# EAGLE schematic fretscanner1 (EAGLE 6.6.0)
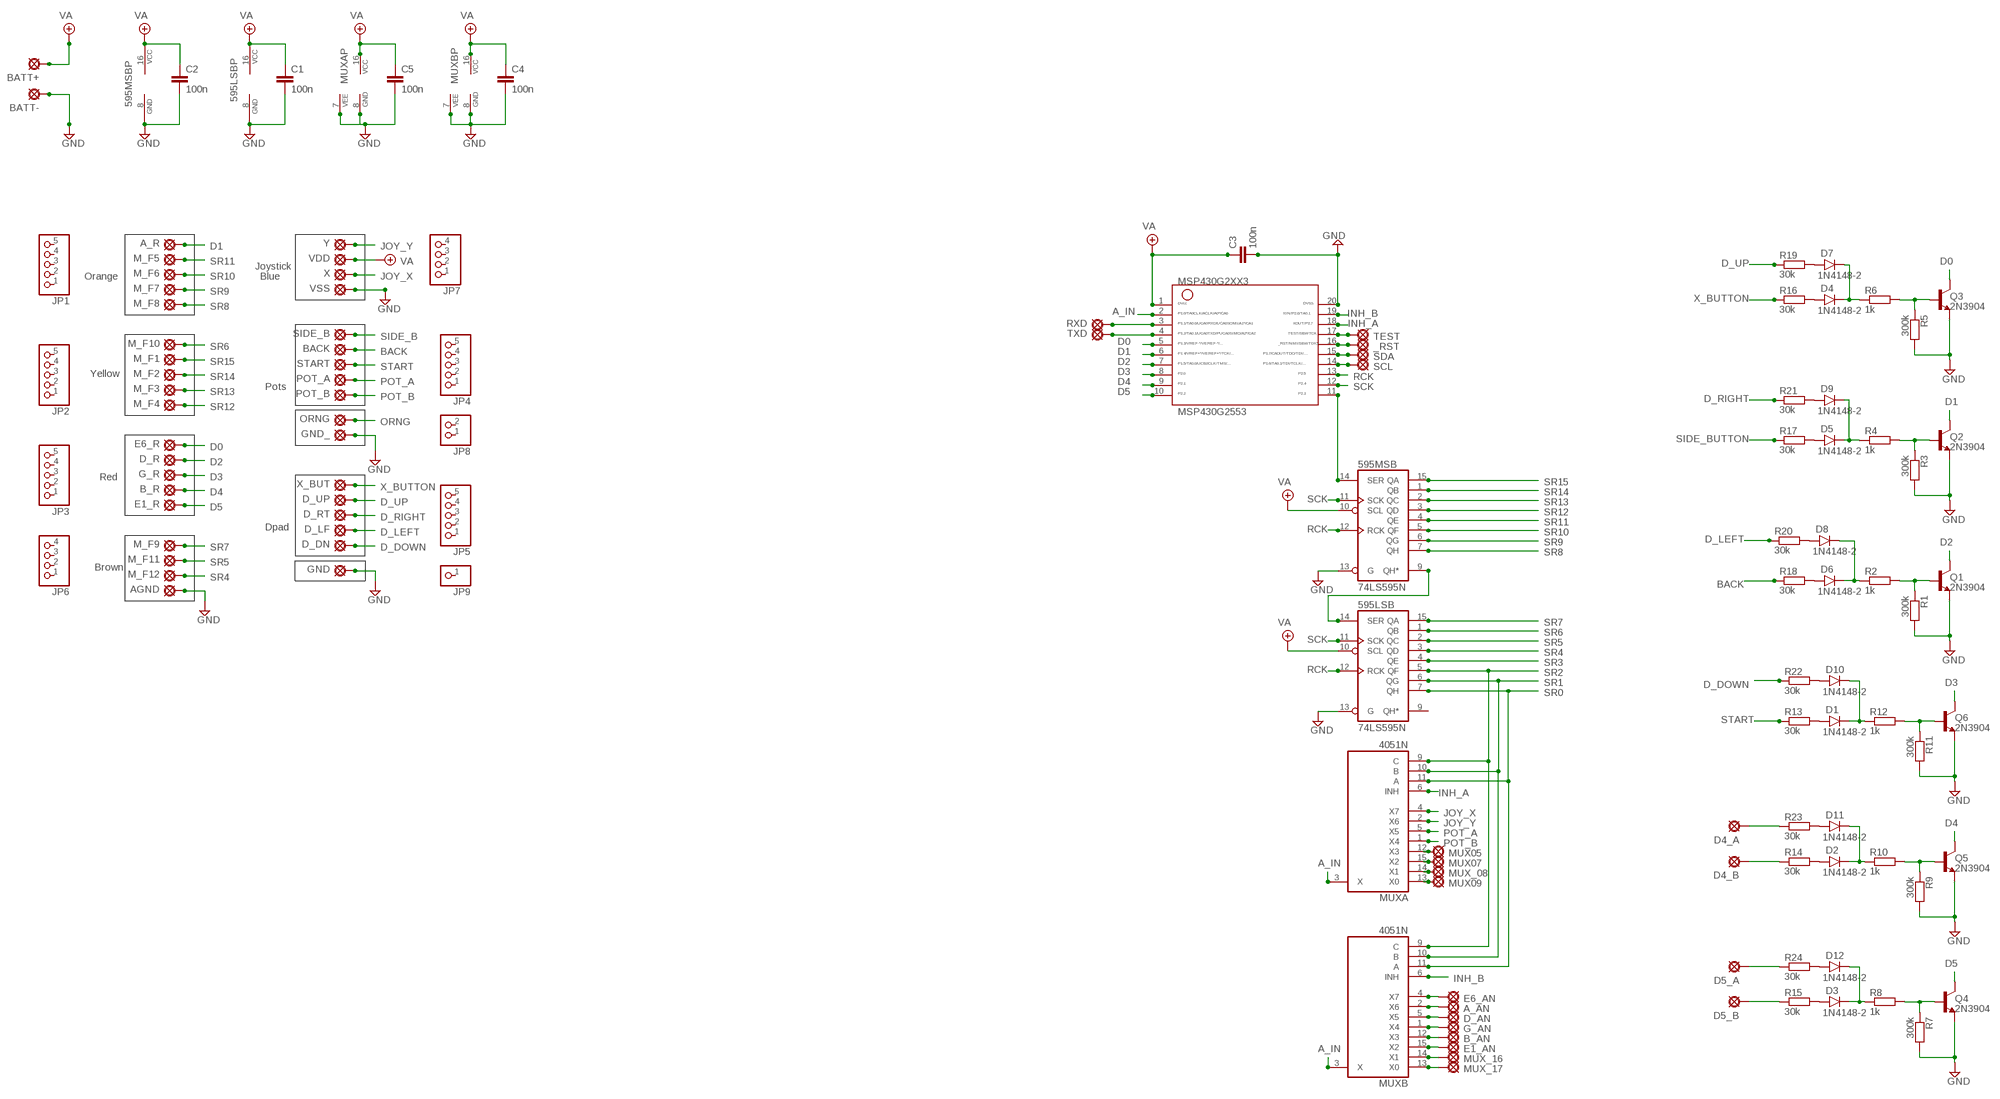
[diagram p0: schematic, sheet 1]

## Parts
595LSB  74LS595N  [DIL16]
595MSB  74LS595N  [DIL16]
_RST  PAD  [SQUARE]
A_AN  PAD  [SQUARE]
A_R  PAD8  [OCTOGON]
AGND  PAD  [SQUARE]
B_AN  PAD  [SQUARE]
B_R  PAD8  [OCTOGON]
BACK  PAD8  [OCTOGON]
BATT+  PADL  [LONG]
BATT-  PADL  [LONG]
C1  100n  050X030_050  [050X030_050_3]
C2  100n  050X030_050  [050X030_050_3]
C3  100n  050X030_050  [050X030_050_3]
C4  100n  050X030_050  [050X030_050_3]
C5  100n  050X030_050  [050X030_050_3]
D1  1N4148-2  [DO35-2]
D2  1N4148-2  [DO35-2]
D3  1N4148-2  [DO35-2]
D4  1N4148-2  [DO35-2]
D4_A  PAD  [SQUARE]
D4_B  PAD  [SQUARE]
D5  1N4148-2  [DO35-2]
D5_A  PAD  [SQUARE]
D5_B  PAD  [SQUARE]
D6  1N4148-2  [DO35-2]
D7  1N4148-2  [DO35-2]
D8  1N4148-2  [DO35-2]
D9  1N4148-2  [DO35-2]
D10  1N4148-2  [DO35-2]
D11  1N4148-2  [DO35-2]
D12  1N4148-2  [DO35-2]
D_AN  PAD  [SQUARE]
D_DN  PAD  [SQUARE]
D_LF  PAD8  [OCTOGON]
D_R  PAD8  [OCTOGON]
D_RT  PAD8  [OCTOGON]
D_UP  PAD8  [OCTOGON]
E1_AN  PAD  [SQUARE]
E1_R  PAD8  [OCTOGON]
E6_AN  PAD  [SQUARE]
E6_R  PAD  [SQUARE]
G_AN  PAD  [SQUARE]
G_R  PAD8  [OCTOGON]
GND  PAD  [SQUARE]
GND_  PAD8  [OCTOGON]
JP1  PINHD-1X5  [1X05]
JP2  PINHD-1X5  [1X05]
JP3  PINHD-1X5  [1X05]
JP4  PINHD-1X5  [1X05]
JP5  PINHD-1X5  [1X05]
JP6  PINHD-1X4  [1X04]
JP7  PINHD-1X4  [1X04]
JP8  PINHD-1X2  [1X02]
JP9  PINHD-1X1  [1X01]
M_F1  PAD8  [OCTOGON]
M_F2  PAD8  [OCTOGON]
M_F3  PAD8  [OCTOGON]
M_F4  PAD  [SQUARE]
M_F5  PAD8  [OCTOGON]
M_F6  PAD8  [OCTOGON]
M_F7  PAD8  [OCTOGON]
M_F8  PAD  [SQUARE]
M_F9  PAD8  [OCTOGON]
M_F10  PAD8  [OCTOGON]
M_F11  PAD8  [OCTOGON]
M_F12  PAD8  [OCTOGON]
MSP430G2553  G2XX3---N20  [N20]
MUX05  PAD  [SQUARE]
MUX07  PAD  [SQUARE]
MUX09  PAD  [SQUARE]
MUX_08  PAD  [SQUARE]
MUX_16  PAD  [SQUARE]
MUX_17  PAD  [SQUARE]
MUXA  4051N  [DIL16]
MUXB  4051N  [DIL16]
ORNG  PAD8  [OCTOGON]
POT_A  PAD8  [OCTOGON]
POT_B  PAD  [SQUARE]
Q1  2N3904  [TO92-]
Q2  2N3904  [TO92-]
Q3  2N3904  [TO92-]
Q4  2N3904  [TO92-]
Q5  2N3904  [TO92-]
Q6  2N3904  [TO92-]
R1  300k  6MM-EU  [R0207/3]
R2  1k  6MM-EU  [R0207/3]
R3  300k  6MM-EU  [R0207/3]
R4  1k  6MM-EU  [R0207/3]
R5  300k  6MM-EU  [R0207/3]
R6  1k  6MM-EU  [R0207/3]
R7  300k  6MM-EU  [R0207/3]
R8  1k  6MM-EU  [R0207/3]
R9  300k  6MM-EU  [R0207/3]
R10  1k  6MM-EU  [R0207/3]
R11  300k  6MM-EU  [R0207/3]
R12  1k  6MM-EU  [R0207/3]
R13  30k  6MM-EU  [R0207/3]
R14  30k  6MM-EU  [R0207/3]
R15  30k  6MM-EU  [R0207/3]
R16  30k  6MM-EU  [R0207/3]
R17  30k  6MM-EU  [R0207/3]
R18  30k  6MM-EU  [R0207/3]
R19  30k  6MM-EU  [R0207/3]
R20  30k  6MM-EU  [R0207/3]
R21  30k  6MM-EU  [R0207/3]
R22  30k  6MM-EU  [R0207/3]
R23  30k  6MM-EU  [R0207/3]
R24  30k  6MM-EU  [R0207/3]
RXD  PAD  [SQUARE]
SCL  PAD  [SQUARE]
SDA  PAD8  [OCTOGON]
SIDE_B  PAD8  [OCTOGON]
START  PAD8  [OCTOGON]
TEST  PAD8  [OCTOGON]
TXD  PAD8  [OCTOGON]
VDD  PAD8  [OCTOGON]
VSS  PAD8  [OCTOGON]
X  PAD8  [OCTOGON]
X_BUT  PAD8  [OCTOGON]
Y  PAD  [SQUARE]

## Nets
_RST: _RST.1(PAD) MSP430G2553.16
A_AN: A_AN.1(PAD) MUXB.2(X6)
A_IN: MSP430G2553.2 MUXA.3(X) MUXB.3(X)
B_AN: B_AN.1(PAD) MUXB.12(X3)
BACK: BACK.1(PAD) R18.1
D0: E6_R.1(PAD) MSP430G2553.5 Q3.1(C)
D1: A_R.1(PAD) MSP430G2553.6 Q2.1(C)
D2: D_R.1(PAD) MSP430G2553.7 Q1.1(C)
D3: G_R.1(PAD) MSP430G2553.8 Q6.1(C)
D4: B_R.1(PAD) MSP430G2553.9 Q5.1(C)
D5: E1_R.1(PAD) MSP430G2553.10 Q4.1(C)
D_AN: D_AN.1(PAD) MUXB.5(X5)
D_DOWN: D_DN.1(PAD) R22.1
D_LEFT: R20.1
D_RIGHT: D_RT.1(PAD) R21.1
D_UP: D_UP.1(PAD) R19.1
E1_AN: E1_AN.1(PAD) MUXB.15(X2)
E6_AN: E6_AN.1(PAD) MUXB.4(X7)
G_AN: G_AN.1(PAD) MUXB.1(X4)
GND: 595LSB.8(GND) 595LSB.13(G) 595MSB.8(GND) 595MSB.13(G) BATT-.1(PAD) C1.2 C2.2 C3.2 C4.2 C5.2 GND.1(PAD) GND_.1(PAD) MSP430G2553.20 MUXA.7(VEE) MUXA.8(GND) MUXB.7(VEE) MUXB.8(GND) Q1.3(E) Q2.3(E) Q3.3(E) Q4.3(E) Q5.3(E) Q6.3(E) R1.2 R3.2 R5.2 R7.2 R9.2 R11.2 VSS.1(PAD)
INH_A: MSP430G2553.18 MUXA.6(INH)
INH_B: MSP430G2553.19 MUXB.6(INH)
JOY_X: MUXA.4(X7) X.1(PAD)
JOY_Y: MUXA.2(X6) Y.1(PAD)
MUX05: MUX05.1(PAD) MUXA.12(X3)
MUX07: MUX07.1(PAD) MUXA.15(X2)
MUX08: MUX_08.1(PAD) MUXA.14(X1)
MUX09: MUX09.1(PAD) MUXA.13(X0)
MUX16: MUX_16.1(PAD) MUXB.14(X1)
MUX17: MUX_17.1(PAD) MUXB.13(X0)
N$1: 595LSB.14(SER) 595MSB.9(QH*)
N$2: Q2.2(B) R3.1 R4.2
N$3: D3.A R15.2
N$4: D5.C D9.C R4.1
N$5: Q3.2(B) R5.1 R6.2
N$6: Q1.2(B) R1.1 R2.2
N$7: D6.C D8.C R2.1
N$8: D4.A R16.2
N$9: D5.A R17.2
N$10: D4.C D7.C R6.1
N$11: Q4.2(B) R7.1 R8.2
N$12: D6.A R18.2
N$13: D3.C D12.C R8.1
N$14: Q5.2(B) R9.1 R10.2
N$15: D1.A R13.2
N$16: M_F7.1(PAD)
N$17: D2.C D11.C R10.1
N$18: Q6.2(B) R11.1 R12.2
N$19: D2.A R14.2
N$20: D1.C D10.C R12.1
N$21: D7.A R19.2
N$22: D8.A R20.2
N$23: D9.A R21.2
N$24: D10.A R22.2
N$25: D4_B.1(PAD) R14.1
N$26: D5_B.1(PAD) R15.1
N$27: D11.A R23.2
N$28: M_F3.1(PAD)
N$29: D12.A R24.2
N$30: D4_A.1(PAD) R23.1
N$31: D5_A.1(PAD) R24.1
N$48: AGND.1(PAD)
N$60: POT_A.1(PAD)
N$66: D_LF.1(PAD)
ORNG: ORNG.1(PAD)
POT_A: MUXA.5(X5)
POT_B: MUXA.1(X4) POT_B.1(PAD)
RCK: 595LSB.12(RCK) 595MSB.12(RCK) MSP430G2553.13
RXD: MSP430G2553.3 RXD.1(PAD)
SCK: 595LSB.11(SCK) 595MSB.11(SCK) MSP430G2553.12
SCL: MSP430G2553.14 SCL.1(PAD)
SDA: MSP430G2553.15 SDA.1(PAD)
SER: 595MSB.14(SER) MSP430G2553.11
SIDE_B: SIDE_B.1(PAD)
SIDE_BUTTON: R17.1
SR0: 595LSB.7(QH) MUXA.11(A) MUXB.11(A)
SR1: 595LSB.6(QG) MUXA.10(B) MUXB.10(B)
SR2: 595LSB.5(QF) MUXA.9(C) MUXB.9(C)
SR3: 595LSB.4(QE)
SR4: 595LSB.3(QD) M_F12.1(PAD)
SR5: 595LSB.2(QC) M_F11.1(PAD)
SR6: 595LSB.1(QB) M_F10.1(PAD)
SR7: 595LSB.15(QA) M_F9.1(PAD)
SR8: 595MSB.7(QH) M_F8.1(PAD)
SR9: 595MSB.6(QG)
SR10: 595MSB.5(QF) M_F6.1(PAD)
SR11: 595MSB.4(QE) M_F5.1(PAD)
SR12: 595MSB.3(QD) M_F4.1(PAD)
SR13: 595MSB.2(QC)
SR14: 595MSB.1(QB) M_F2.1(PAD)
SR15: 595MSB.15(QA) M_F1.1(PAD)
START: R13.1 START.1(PAD)
TEST: MSP430G2553.17 TEST.1(PAD)
TXD: MSP430G2553.4 TXD.1(PAD)
VA: 595LSB.10(SCL) 595LSB.16(VCC) 595MSB.10(SCL) 595MSB.16(VCC) BATT+.1(PAD) C1.1 C2.1 C3.1 C4.1 C5.1 MSP430G2553.1 MUXA.16(VCC) MUXB.16(VCC) VDD.1(PAD)
X_BUTTON: R16.1 X_BUT.1(PAD)
Unconnected: 595LSB.9(QH*) JP1.1 JP1.2 JP1.3 JP1.4 JP1.5 JP2.1 JP2.2 JP2.3 JP2.4 JP2.5 JP3.1 JP3.2 JP3.3 JP3.4 JP3.5 JP4.1 JP4.2 JP4.3 JP4.4 JP4.5 JP5.1 JP5.2 JP5.3 JP5.4 JP5.5 JP6.1 JP6.2 JP6.3 JP6.4 JP7.1 JP7.2 JP7.3 JP7.4 JP8.1 JP8.2 JP9.1

## Notes on the sheet
- Joystick
- Orange | Blue
- Yellow
- Pots
- Red
- Dpad
- Brown

## Library data of the parts
595LSB 595MSB = 74xx-us:74*595: 8-bit SHIFT REGISTER, output latch
_RST A_AN A_R AGND B_AN B_R BACK BATT+ BATT- D4_A D4_B D5_A D5_B D_AN D_DN D_LF D_R D_RT D_UP E1_AN E1_R E6_AN E6_R G_AN G_R GND GND_ M_F1-M_F12 MUX05 MUX07 MUX09 MUX_08 MUX_16 MUX_17 ORNG POT_A POT_B RXD SCL SDA SIDE_B START TEST TXD VDD VSS X X_BUT Y = gm-supply:PAD: PAD use this package for pads with any purpose, including input, output, send or return various pad shapes: round, square, octogonal, long, and long offset
C1-C5 = gm-caps-ceramic:050X030_050: 120 - 150pF Xicon Ceramic Disc 5mm lead spacing
D1-D12 = gm-diodes:1N4148: Fast Switching Diode DO-35 glass case a.k.a. 1N914
JP1-JP5 = pinhead:PINHD-1X5: PIN HEADER
JP6 JP7 = pinhead:PINHD-1X4: PIN HEADER
JP8 = pinhead:PINHD-1X2: PIN HEADER
JP9 = pinhead:PINHD-1X1: PIN HEADER
MSP430G2553 = TI_MSP430_v16:G2XX3---N20: MSP430G2XX1 PDIP (N) 20 Pin Package
MUXA MUXB = 40xx:4051: 8-channel ANALOG MULTIPLEXER
Q1-Q6 = gm-trans:2N3904: NPN Transistor
R1-R24 = gm-resistors:6MM-EU: 6mm Resistors (European schematic symbol) Leads spaced 1-6 holes apart for 0.1" perfboard. Suitable for 1/4 watt resistors.